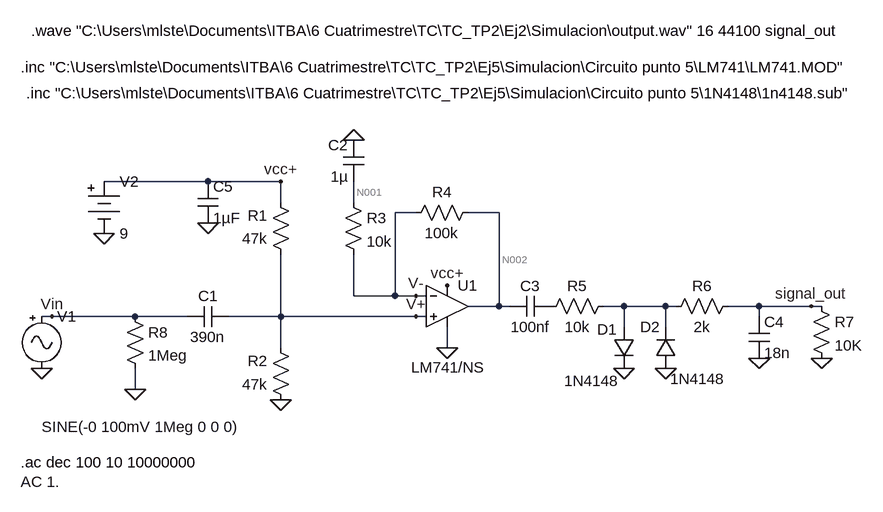
[diagram p0: schematic punto 5.asc]
punto 5.asc, the LTspice schematic file:
Version 4
SHEET 1 1692 680
WIRE -288 -80 -448 -80
WIRE -176 -80 -288 -80
WIRE -176 -48 -176 -80
WIRE -64 -48 -64 -80
WIRE 32 -32 0 -32
WIRE 160 -32 112 -32
WIRE -64 96 -64 32
WIRE 0 96 0 -32
WIRE 0 96 -64 96
WIRE 32 96 0 96
WIRE 48 96 32 96
WIRE 160 112 160 -32
WIRE 160 112 112 112
WIRE 176 112 160 112
WIRE 352 112 320 112
WIRE 416 112 352 112
WIRE 432 112 416 112
WIRE 560 112 512 112
WIRE 640 112 560 112
WIRE 656 112 640 112
WIRE -528 128 -544 128
WIRE -400 128 -528 128
WIRE -320 128 -400 128
WIRE -176 128 -176 32
WIRE -176 128 -256 128
WIRE 32 128 -176 128
WIRE 48 128 32 128
WIRE 560 128 560 112
WIRE 352 144 352 112
WIRE 416 144 416 112
WIRE -176 176 -176 128
WIRE 80 176 80 144
WIRE -400 240 -400 208
FLAG 32 128 V+
FLAG 32 96 V-
FLAG -64 -144 0
FLAG 352 208 0
FLAG 416 208 0
FLAG 560 192 0
FLAG 80 176 0
FLAG -176 256 0
FLAG 656 192 0
FLAG -288 -16 0
FLAG -400 240 0
FLAG -544 208 0
FLAG -448 0 0
FLAG 640 112 signal_out
FLAG -528 128 Vin
FLAG -176 -80 vcc+
FLAG 80 80 vcc+
SYMBOL Opamps\\opamp2 80 48 R0
WINDOW 3 -55 158 Left 2
SYMATTR Value LM741/NS
SYMATTR InstName U1
SYMBOL res -160 48 R180
WINDOW 0 36 76 Left 2
WINDOW 3 36 40 Left 2
SYMATTR InstName R1
SYMATTR Value 47k
SYMBOL res -160 272 R180
WINDOW 0 36 76 Left 2
WINDOW 3 36 40 Left 2
SYMATTR InstName R2
SYMATTR Value 47k
SYMBOL res -80 -64 R0
SYMATTR InstName R3
SYMATTR Value 10k
SYMBOL res 128 -48 R90
WINDOW 0 0 56 VBottom 2
WINDOW 3 32 56 VTop 2
SYMATTR InstName R4
SYMATTR Value 100k
SYMBOL res 336 96 R90
WINDOW 0 0 56 VBottom 2
WINDOW 3 32 56 VTop 2
SYMATTR InstName R5
SYMATTR Value 10k
SYMBOL cap -256 112 R90
WINDOW 0 0 32 VBottom 2
WINDOW 3 32 32 VTop 2
SYMATTR InstName C1
SYMATTR Value 390n
SYMBOL cap -48 -80 R180
WINDOW 0 24 56 Left 2
WINDOW 3 24 8 Left 2
SYMATTR InstName C2
SYMATTR Value 1µ
SYMBOL cap 176 128 R270
WINDOW 0 32 32 VTop 2
WINDOW 3 0 32 VBottom 2
SYMATTR InstName C3
SYMATTR Value 100nf
SYMBOL res 528 96 R90
WINDOW 0 0 56 VBottom 2
WINDOW 3 32 56 VTop 2
SYMATTR InstName R6
SYMATTR Value 2k
SYMBOL cap 544 128 R0
SYMATTR InstName C4
SYMATTR Value 18n
SYMBOL diode 336 144 R0
WINDOW 0 -25 4 Left 2
WINDOW 3 87 80 Left 2
SYMATTR InstName D1
SYMATTR Value 1N4148
SYMBOL diode 432 208 R180
WINDOW 0 24 64 Left 2
WINDOW 3 87 -19 Left 2
SYMATTR InstName D2
SYMATTR Value 1N4148
SYMBOL res 640 96 R0
SYMATTR InstName R7
SYMATTR Value 10K
SYMBOL res -416 112 R0
SYMATTR InstName R8
SYMATTR Value 1Meg
SYMBOL cap -304 -80 R0
SYMATTR InstName C5
SYMATTR Value 1µF
SYMBOL Misc\\battery -448 -96 R0
WINDOW 123 0 0 Left 2
WINDOW 39 0 0 Left 2
SYMATTR InstName V2
SYMATTR Value 9
SYMBOL Misc\\signal -544 112 R0
WINDOW 123 -32 270 Left 2
WINDOW 39 0 0 Left 2
WINDOW 3 0 186 Left 2
SYMATTR Value2 AC 1.
SYMATTR Value SINE(-0 100mV 1Meg 0 0 0)
SYMATTR InstName V1
TEXT -576 -256 Left 2 !.inc "C:\\Users\\mlste\\Documents\\ITBA\\6 Cuatrimestre\\TC\\TC_TP2\\Ej5\\Simulacion\\Circuito punto 5\\LM741\\LM741.MOD"
TEXT -568 -216 Left 2 !.inc "C:\\Users\\mlste\\Documents\\ITBA\\6 Cuatrimestre\\TC\\TC_TP2\\Ej5\\Simulacion\\Circuito punto 5\\1N4148\\1n4148.sub"
TEXT -576 352 Left 2 !.ac dec 100 10 10000000
TEXT -560 -312 Left 2 !.wave "C:\\Users\\mlste\\Documents\\ITBA\\6 Cuatrimestre\\TC\\TC_TP2\\Ej2\\Simulacion\\output.wav" 16 44100 signal_out

The netlist it stands for:
* punto 5.asc
XU1 V+ V- vcc+ 0 N002 LM741/NS  ; pins In+ In- V+ V- OUT
R1 V+ vcc+ 47k
R2 0 V+ 47k
R3 N001 V- 10k
R4 N002 V- 100k
R5 N003 P001 10k
C1 V+ Vin 390n
C2 N001 0 1µ
C3 N002 P001 100nf
R6 signal_out N003 2k
C4 signal_out 0 18n
D1 N003 0 1N4148
D2 0 N003 1N4148
R7 signal_out 0 10K
R8 Vin 0 1Meg
C5 vcc+ 0 1µF
V2 vcc+ 0 9
V1 Vin 0 SINE(-0 100mV 1Meg 0 0 0) AC 1.
.model D D
.lib standard.dio
.inc "C:\Users\mlste\Documents\ITBA\6 Cuatrimestre\TC\TC_TP2\Ej5\Simulacion\Circuito punto 5\LM741\LM741.MOD"
.inc "C:\Users\mlste\Documents\ITBA\6 Cuatrimestre\TC\TC_TP2\Ej5\Simulacion\Circuito punto 5\1N4148\1n4148.sub"
.ac dec 100 10 10000000
.wave "C:\Users\mlste\Documents\ITBA\6 Cuatrimestre\TC\TC_TP2\Ej2\Simulacion\output.wav" 16 44100 signal_out
.backanno
.end

* Results of the author's LTspice run, read from the files saved beside the schematic
* Operating Point, zero values left out:
*   V(v-) = 4.5 V
*   V(v+) = 4.499 V
*   V(vcc+) = 9 V
*   V(n002) = 4.51 V
*   V(n001) = 4.5 V
*   I(R4) = 101.9 nA
*   I(R2) = -95.72 µA
*   I(R1) = -95.77 µA
*   I(V2) = -1.534 mA
*   Ix(u1:1) = 57.87 nA
*   Ix(u1:2) = 101.9 nA
*   Ix(u1:99) = 1.439 mA
*   Ix(u1:50) = -1.439 mA
*   Ix(u1:28) = -101.9 nA
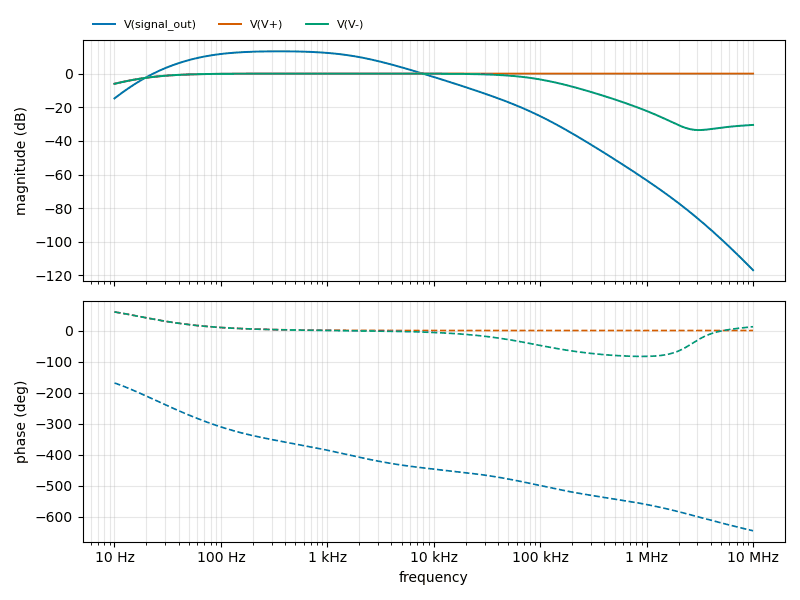
[diagram p1: AC Analysis of punto 5.asc, plotted from the saved traces]
* AC Analysis, 1 run:
*   V(signal_out): -14.74 dB at 10 Hz, -116.86 dB at 10 MHz, peak 13.27 dB at 354.8 Hz, 3 dB below the peak at 71.27 Hz and 1.825 kHz
*   V(V+): -6.04 dB at 10 Hz, -0.00 dB at 10 MHz, peak -0.00 dB at 10 MHz, 3 dB below the peak at 17.37 Hz
*   V(V-): -6.04 dB at 10 Hz, -30.50 dB at 10 MHz, peak -0.00 dB at 1.38 kHz, 3 dB below the peak at 17.36 Hz and 90.33 kHz